# Altium project FMC_ADC_128CH_10B.PrjPCB (part 2 of 4)

## Sheet Supply_FMC_ADC128.SchDoc: FMC ADC 128CH 10B
size 420 x 297 mm; EDA_Number: ARTIQ; Projet: ARTIQ/SINARA; Author: G.Kasprowicz; CompanyName: WUT ISE; DrawnBy: G.Kasprowicz; Organization: WUT ISE; Address1: PW ISE; Address2: Nowowiejska 15/19 00-665 Warsaw; Address3: gkasprow@gmail.com; DocumentNumber: 5; Revision: 1; SheetNumber: 5; SheetTotal: 9; ModifiedBy: -; CheckedDate: -; Title2: Supply FMC ADC 128; DivGrp: WUT ISE; Designer: G.Kasprowicz; ModifiedDate: -; ProjectName: Sensor Box
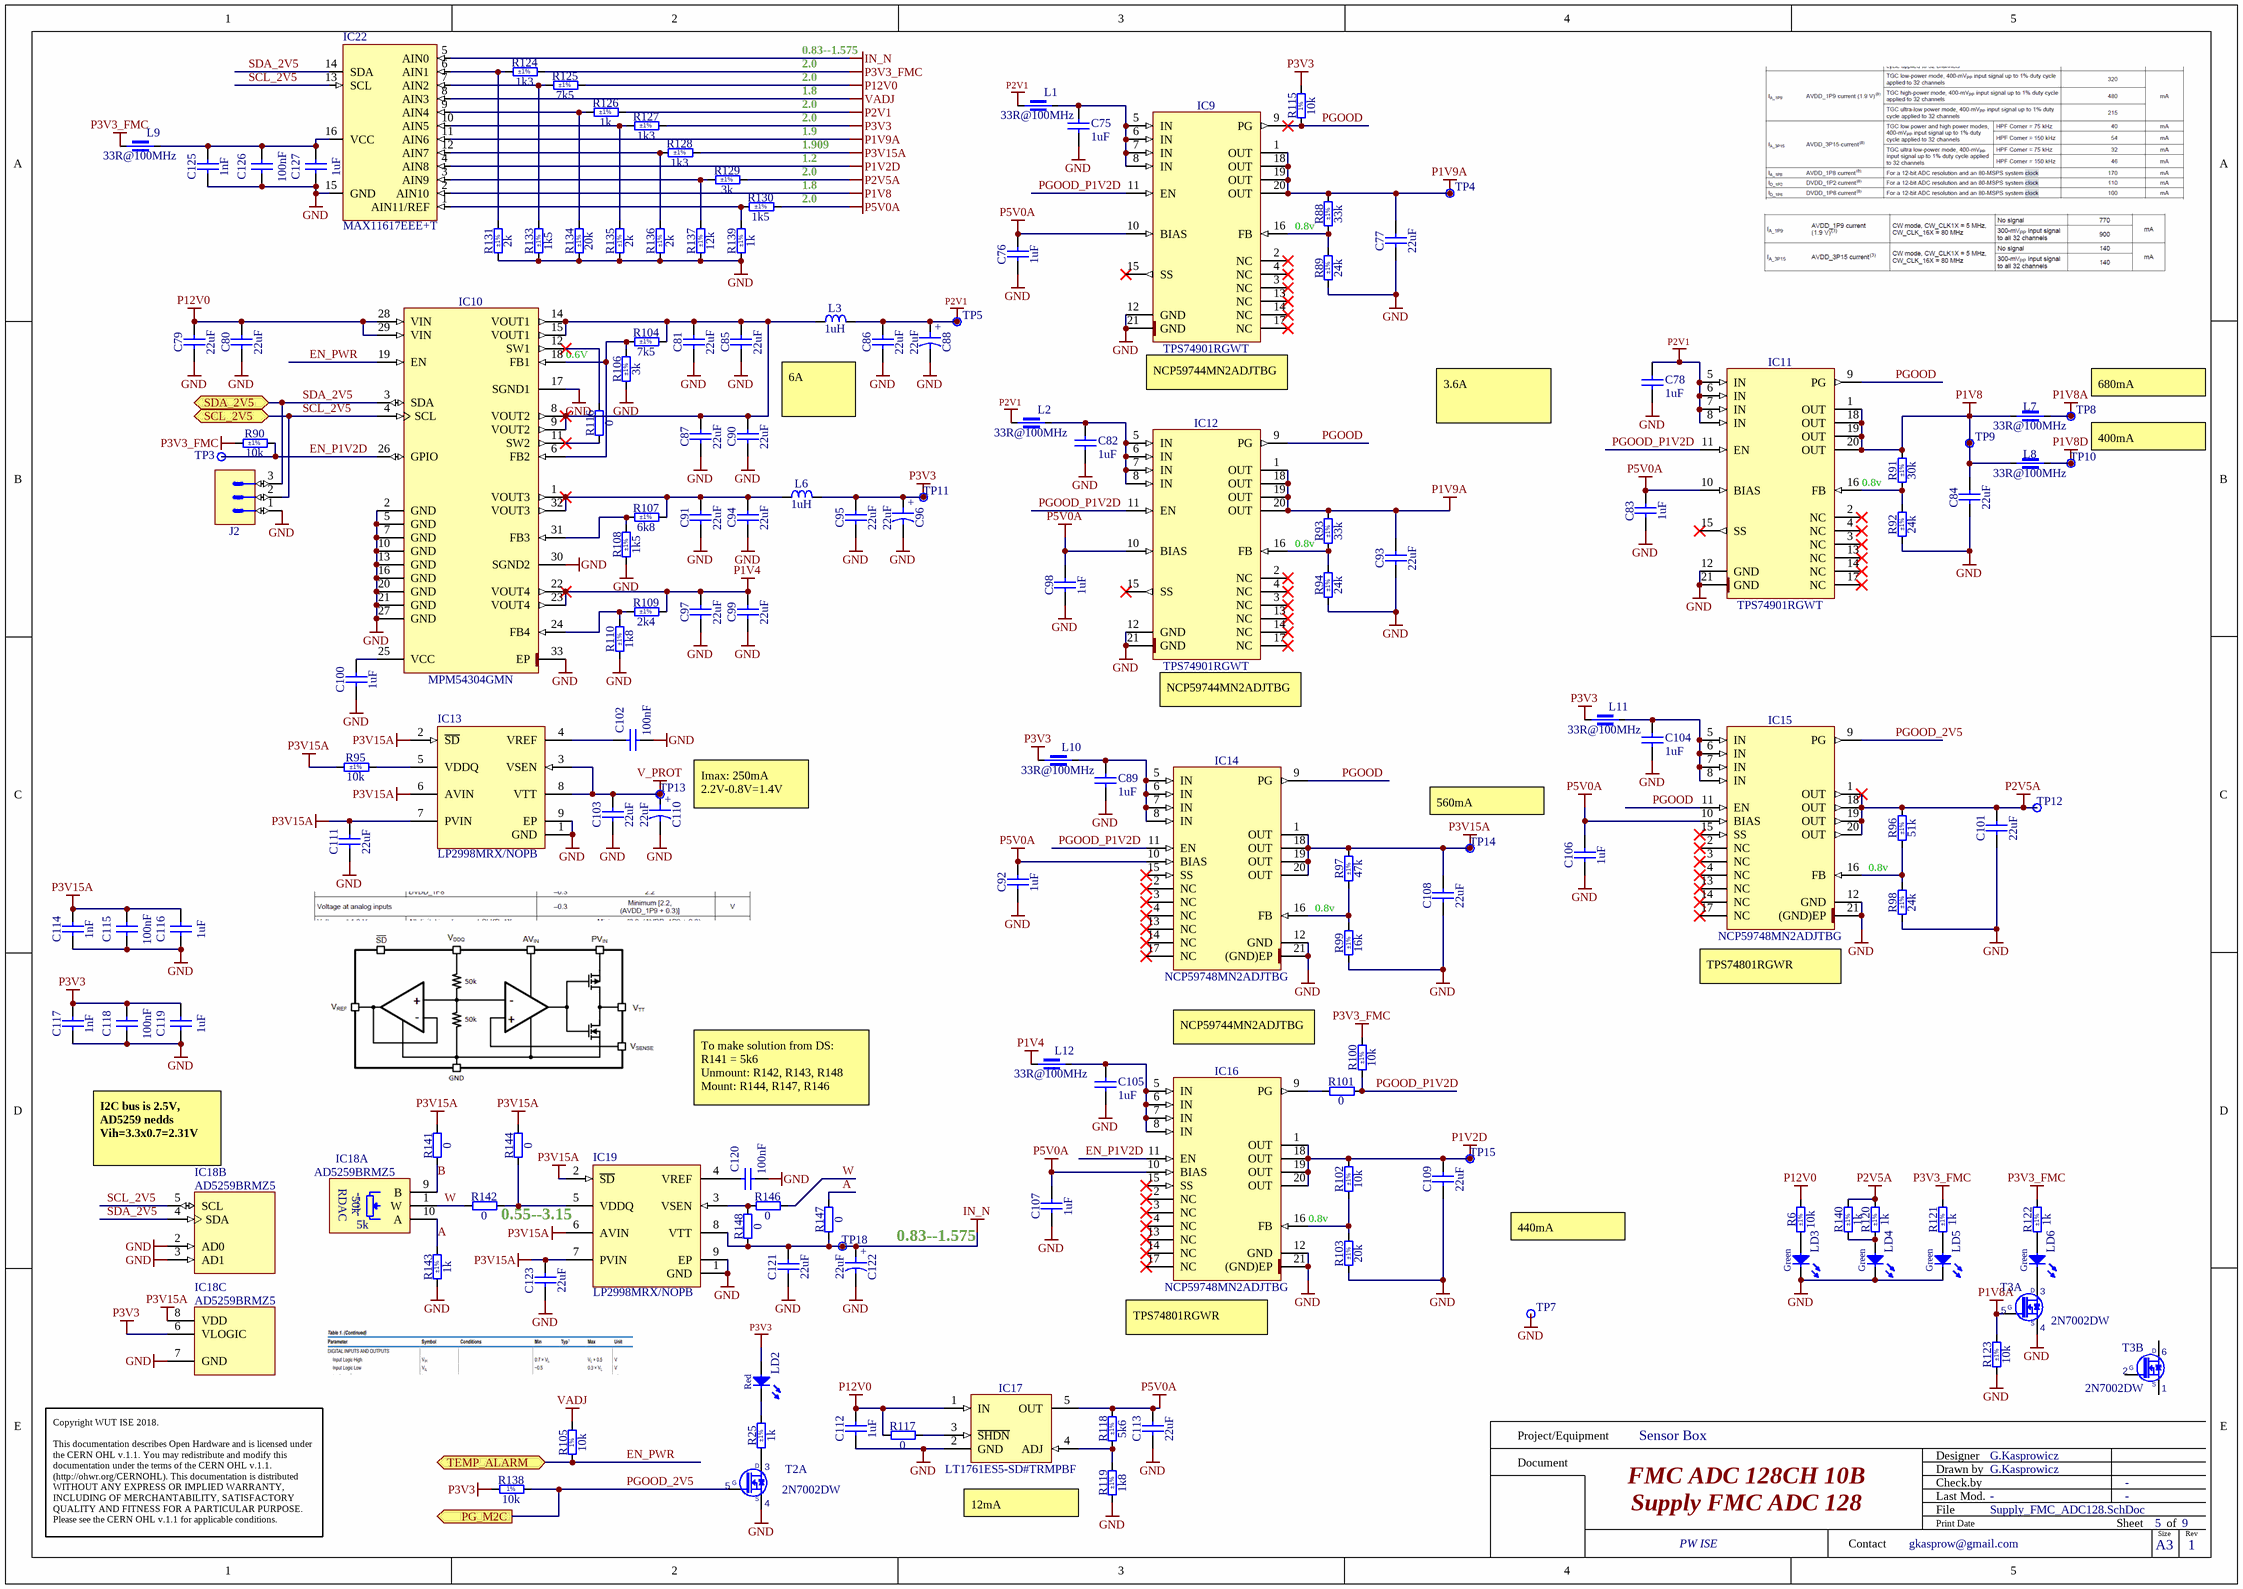
[diagram p3: Supply_FMC_ADC128.SchDoc]

### Parts
(Parts that share a designator on the sheet are numbered #1, #2 ... from top to bottom, then left to right.)
C75  1uF  [CAPC1005X55N]
C76  1uF  [CAPC1005X55N]
C77  22uF  [CAPC2012X135N]
C78  1uF  [CAPC1005X55N]
C79  22uF  [CAPC2012X135N]
C80  22uF  [CAPC2012X135N]
C81  22uF  [CAPC2012X135N]
C82  1uF  [CAPC1005X55N]
C83  1uF  [CAPC1005X55N]
C84  22uF  [CAPC2012X135N]
C85  22uF  [CAPC2012X135N]
C86  22uF  [CAPC2012X135N]
C87  22uF  [CAPC2012X135N]
C88  22uF  [CAPMP3528X210N]
C89  1uF  [CAPC1005X55N]
C90  22uF  [CAPC2012X135N]
C91  22uF  [CAPC2012X135N]
C92  1uF  [CAPC1005X55N]
C93  22uF  [CAPC2012X135N]
C94  22uF  [CAPC2012X135N]
C95  22uF  [CAPC2012X135N]
C96  22uF  [CAPMP3528X210N]
C97  22uF  [CAPC2012X135N]
C98  1uF  [CAPC1005X55N]
C99  22uF  [CAPC2012X135N]
C100  1uF  [CAPC1005X55N]
C101  22uF  [CAPC2012X135N]
C102  100nF  [CAPC1005X55N]
C103  22uF  [CAPC2012X135N]
C104  1uF  [CAPC1005X55N]
C105  1uF  [CAPC1005X55N]
C106  1uF  [CAPC1005X55N]
C107  1uF  [CAPC1005X55N]
C108  22uF  [CAPC2012X135N]
C109  22uF  [CAPC2012X135N]
C110  22uF  [CAPMP3528X210N]
C111  22uF  [CAPC2012X135N]
C112  1uF  [CAPC1005X55N]
C113  22uF  [CAPC2012X135N]
C114  1nF  [CAPC1005X55N]
C115  100nF  [CAPC1005X55N]
C116  1uF  [CAPC1005X55N]
C117  1nF  [CAPC1005X55N]
C118  100nF  [CAPC1005X55N]
C119  1uF  [CAPC1005X55N]
C120  100nF  [CAPC1005X55N]
C121  22uF  [CAPC2012X135N]
C122  22uF  [CAPMP3528X210N]
C123  22uF  [CAPC2012X135N]
C125  1nF  [CAPC1005X55N]
C126  100nF  [CAPC1005X55N]
C127  1uF  [CAPC1005X55N]
IC9  TPS74901RGWT  [QFN65P500X500X100-21N-S325]
IC10  MPM54304GMN  [MPS_MPM54304GMN]
IC11  TPS74901RGWT  [QFN65P500X500X100-21N-S325]
IC12  TPS74901RGWT  [QFN65P500X500X100-21N-S325]
IC13  LP2998MRX/NOPB  [DDA0008D_M]
IC14  NCP59748MN2ADJTBG  [QFN65P500X500X100-21N-S325]
IC15  NCP59748MN2ADJTBG  [QFN65P500X500X100-21N-S325]
IC16  NCP59748MN2ADJTBG  [QFN65P500X500X100-21N-S325]
IC17  LT1761ES5-SD#TRMPBF  [SOT95P280X100-5N]
IC18  AD5259BRMZ5  [SOP50P490X110-10N]  (parts A,B,C of 3)
IC19  LP2998MRX/NOPB  [DDA0008D_M]
IC22  MAX11617EEE+T  [16 QSOP]
J2#1  C-Grid III™  [MOLEX_90121-0763]  (value not drawn)
L1  33R@100MHz  [INDC1608X95N]
L2  33R@100MHz  [INDC1608X95N]
L3  1uH  [IND_BOURNS_SRP4020TA]
L6  1uH  [IND_BOURNS_SRN3015]
L7  33R@100MHz  [INDC1608X95N]
L8  33R@100MHz  [INDC1608X95N]
L9  33R@100MHz  [INDC1608X95N]
L10  33R@100MHz  [INDC1608X95N]
L11  33R@100MHz  [INDC1608X95N]
L12  33R@100MHz  [INDC1608X95N]
LD2  Red  [LED_AVAGO_HSMC-C110]
LD3  Green  [LED_KINGBRIGHT_KPA-1606CGCK]
LD4  Green  [LED_KINGBRIGHT_KPA-1606CGCK]
LD5  Green  [LED_KINGBRIGHT_KPA-1606CGCK]
LD6  Green  [LED_KINGBRIGHT_KPA-1606CGCK]
R6  10k  Tolerance: ±1%  [RESC1005X40N]
R25  1k  Tolerance: ±1%  [RESC1005X40N]
R88  33k  Tolerance: ±1%  [RESC1005X40N]
R89  24k  Tolerance: ±1%  [RESC1005X40N]
R90  10k  Tolerance: ±1%  [RESC1005X40N]
R91  30k  Tolerance: ±1%  [RESC1005X40N]
R92  24k  Tolerance: ±1%  [RESC1005X40N]
R93  33k  Tolerance: ±1%  [RESC1005X40N]
R94  24k  Tolerance: ±1%  [RESC1005X40N]
R95  10k  Tolerance: ±1%  [RESC1005X40N]
R96  51k  Tolerance: ±1%  [RESC1005X40N]
R97  47k  Tolerance: ±1%  [RESC1005X40N]
R98  24k  Tolerance: ±1%  [RESC1005X40N]
R99  16k  Tolerance: ±1%  [RESC1005X40N]
R100  10k  Tolerance: ±1%  [RESC1005X40N]
R101  0  [RESC1005X40N]
R102  10k  Tolerance: ±1%  [RESC1005X40N]
R103  20k  Tolerance: ±1%  [RESC1005X40N]
R104  7k5  Tolerance: ±1%  [RESC1005X40N]
R105  10k  [RESC1005X40N]
R106  3k  Tolerance: ±1%  [RESC1005X40N]
R107  6k8  Tolerance: ±1%  [RESC1005X40N]
R108  1k5  Tolerance: ±1%  [RESC1005X40N]
R109  2k4  Tolerance: ±1%  [RESC1005X40N]
R110  1k8  Tolerance: ±1%  [RESC1005X40N]
R115  10k  [RESC1005X40N]
R116  0  [RESC1005X40N]
R117  0  [RESC1005X40N]
R118  5k6  Tolerance: ±1%  [RESC1005X40N]
R119  1k8  Tolerance: ±1%  [RESC1005X40N]
R120  1k  Tolerance: ±1%  [RESC1005X40N]
R121  1k  Tolerance: ±1%  [RESC1005X40N]
R122  1k  Tolerance: ±1%  [RESC1005X40N]
R123  10k  Tolerance: ±1%  [RESC1005X40N]
R124  1k3  Tolerance: ±1%  [RESC1005X40N]
R125  7k5  Tolerance: ±1%  [RESC1005X40N]
R126  1k  Tolerance: ±1%  [RESC1005X40N]
R127  1k3  Tolerance: ±1%  [RESC1005X40N]
R128  1k3  Tolerance: ±1%  [RESC1005X40N]
R129  3k  Tolerance: ±1%  [RESC1005X40N]
R130  1k5  Tolerance: ±1%  [RESC1005X40N]
R131  2k  Tolerance: ±1%  [RESC1005X40N]
R133  1k5  Tolerance: ±1%  [RESC1005X40N]
R134  20k  Tolerance: ±1%  [RESC1005X40N]
R135  2k  Tolerance: ±1%  [RESC1005X40N]
R136  2k  Tolerance: ±1%  [RESC1005X40N]
R137  12k  Tolerance: ±1%  [RESC1005X40N]
R138  10k  [RESC1005X40N]
R139  1k  Tolerance: ±1%  [RESC1005X40N]
R140  1k  Tolerance: ±1%  [RESC1005X40N]
R141  0  [RESC1005X40N]
R142  0  [RESC1005X40N]
R143  1k  Tolerance: ±1%  [RESC1005X40N]
R144  0  [RESC1005X40N]
R146  0  [RESC1005X40N]
R147  0  [RESC1005X40N]
R148  0  [RESC1005X40N]
T2  2N7002DW  [SOT65P210X110-6N]  (part A of 2)
T3  2N7002DW  [SOT65P210X110-6N]  (parts A,B of 2)
TP3  Test Point  [TPS127]  (value not drawn)  (no BOM)
TP4  Test Point  [TPS127]  (value not drawn)  (no BOM)
TP5  Test Point  [TPS127]  (value not drawn)  (no BOM)
TP7  Test Point  [TPS127]  (value not drawn)  (no BOM)
TP8  Test Point  [TPS127]  (value not drawn)  (no BOM)
TP9  Test Point  [TPS127]  (value not drawn)  (no BOM)
TP10  Test Point  [TPS127]  (value not drawn)  (no BOM)
TP11  Test Point  [TPS127]  (value not drawn)  (no BOM)
TP12  Test Point  [TPS127]  (value not drawn)  (no BOM)
TP13  Test Point  [TPS127]  (value not drawn)  (no BOM)
TP14  Test Point  [TPS127]  (value not drawn)  (no BOM)
TP15  Test Point  [TPS127]  (value not drawn)  (no BOM)
TP18  Test Point  [TPS127]  (value not drawn)  (no BOM)

### Ports
PG_M2C (out), SCL_2V5 (bidir), SDA_2V5 (bidir), TEMP_ALARM (bidir)

### Nets
GND: C75.2 C76.1 C77.1 C78.2 C79.1 C80.1 C81.1 C82.2 C83.1 C84.1 C85.1 C86.1 C87.1 C88.2 C89.2 C90.1 C91.1 C92.1 C93.1 C94.1 C95.1 C96.2 C97.1 C98.1 C99.1 C100.1 C101.1 C102.2 C103.1 C104.2 C105.2 C106.1 C107.1 C108.1 C109.1 C110.2 C111.1 C112.1 C113.1 C114.1 C115.2 C116.1 C117.1 C118.2 C119.1 C120.2 C121.1 C122.2 C123.1 C125.1 C126.2 C127.1 IC9.12(GND) IC9.21(GND) IC10.2(GND) IC10.5(GND) IC10.7(GND) IC10.10(GND) IC10.13(GND) IC10.16(GND) IC10.17(SGND1) IC10.20(GND) IC10.21(GND) IC10.27(GND) IC10.30(SGND2) IC10.33(EP) IC11.12(GND) IC11.21(GND) IC12.12(GND) IC12.21(GND) IC13.1(GND) IC13.9(EP) IC14.12(GND) IC14.21((GND)EP) IC15.12(GND) IC15.21((GND)EP) IC16.12(GND) IC16.21((GND)EP) IC17.2(GND) IC18.2(AD0) IC18.3(AD1) IC18.7(GND) IC19.1(GND) IC19.9(EP) IC22.15(GND) J2#1.1 LD3.1(C) LD4.1(C) LD5.1(C) R89.1 R92.1 R94.1 R98.1 R99.1 R103.1 R106.1 R108.1 R110.1 R119.1 R123.1 R131.1 R133.1 R134.1 R135.1 R136.1 R137.1 R139.1 R143.1 T2.4(S1) T3.4(S1) TP7.1
IN_N: C121.2 C122.1 IC19.8(VTT) IC22.5(AIN0) R147.1 R148.1 TP18.1
P1V2D: C109.2 IC16.1(OUT) IC16.18(OUT) IC16.19(OUT) IC16.20(OUT) IC22.4(AIN8) R102.2 TP15.1
P1V4: C97.2 C99.2 IC10.22(VOUT4) IC10.23(VOUT4) L12.1 R109.2
P1V8: C84.2 IC11.1(OUT) IC11.18(OUT) IC11.19(OUT) IC11.20(OUT) IC22.2(AIN10) L7.1 L8.1 R91.2 TP9.1
P1V8A: L7.2 R123.2 T3.5(G1) TP8.1
P1V8D: L8.2 TP10.1
P1V9A: C77.2 C93.2 IC9.1(OUT) IC9.18(OUT) IC9.19(OUT) IC9.20(OUT) IC12.1(OUT) IC12.18(OUT) IC12.19(OUT) IC12.20(OUT) IC22.11(AIN6) R88.2 R93.2 TP4.1
P2V1: C78.1 C86.2 C88.1 IC11.5(IN) IC11.6(IN) IC11.7(IN) IC11.8(IN) L1.1 L2.1 L3.2 R126.2 TP5.1
P2V5A: C101.2 IC15.1(OUT) IC15.18(OUT) IC15.19(OUT) IC15.20(OUT) R96.2 R120.2 R129.2 R140.2 TP12.1
P3V3: C95.2 C96.1 C117.2 C118.1 C119.2 IC18.6(VLOGIC) L6.2 L10.1 L11.1 LD2.2(A) R115.2 R127.2 R138.1 TP11.1
P3V3_FMC: L9.1 R90.1 R100.2 R121.2 R122.2 R124.2
P3V15A: C108.2 C111.2 C114.2 C115.1 C116.2 C123.2 IC13.2(~{SD}) IC13.6(AVIN) IC13.7(PVIN) IC14.1(OUT) IC14.18(OUT) IC14.19(OUT) IC14.20(OUT) IC18.8(VDD) IC19.2(~{SD}) IC19.6(AVIN) IC19.7(PVIN) R95.1 R97.2 R128.2 R141.2 R144.2 TP14.1
P5V0A: C76.2 C83.2 C92.2 C98.2 C106.2 C107.2 C113.2 IC9.10(BIAS) IC11.10(BIAS) IC12.10(BIAS) IC14.10(BIAS) IC15.10(BIAS) IC16.10(BIAS) IC17.5(OUT) R118.2 R130.2
P12V0: C79.2 C80.2 C112.2 IC10.28(VIN) IC10.29(VIN) IC17.1(IN) R6.2 R117.1 R125.2
V_PROT: C103.2 C110.1 IC13.3(VSEN) IC13.8(VTT) TP13.1
VADJ: IC22.8(AIN3) R105.2
A: IC18.10(A) R143.2 R147.2
B: IC18.9(B) R141.1
EN_P1V2D: IC10.26(GPIO) IC16.11(EN) R90.2 TP3.1
EN_PWR: IC10.19(EN) R105.1 ; port TEMP_ALARM
PGOOD: IC9.9(PG) IC11.9(PG) IC12.9(PG) IC14.9(PG) IC15.11(EN) R115.1
PGOOD_2V5: IC15.9(PG) R138.2 T2.5(G1) ; port PG_M2C  [project net PG_M2C]
PGOOD_P1V2D: IC9.11(EN) IC11.11(EN) IC12.11(EN) IC14.11(EN) R100.1 R101.2
SCL_2V5: IC10.4(SCL) IC18.5(SCL) IC22.13(SCL) J2#1.2 ; port SCL_2V5
SDA_2V5: IC10.3(SDA) IC18.4(SDA) IC22.14(SDA) J2#1.3 ; port SDA_2V5
W: IC18.1(W) R142.1 R146.2
NetC75_1: C75.1 IC9.5(IN) IC9.6(IN) IC9.7(IN) IC9.8(IN) L1.2
NetC81_2: C81.2 C85.2 C87.2 C90.2 IC10.8(VOUT2) IC10.9(VOUT2) IC10.14(VOUT1) IC10.15(VOUT1) L3.1 R104.2
NetC82_1: C82.1 IC12.5(IN) IC12.6(IN) IC12.7(IN) IC12.8(IN) L2.2
NetC89_1: C89.1 IC14.5(IN) IC14.6(IN) IC14.7(IN) IC14.8(IN) L10.2
NetC91_2: C91.2 C94.2 IC10.1(VOUT3) IC10.32(VOUT3) L6.1 R107.2
NetC100_2: C100.2 IC10.25(VCC)
NetC102_1: C102.1 IC13.4(VREF)
NetC104_1: C104.1 IC15.5(IN) IC15.6(IN) IC15.7(IN) IC15.8(IN) L11.2
NetC105_1: C105.1 IC16.5(IN) IC16.6(IN) IC16.7(IN) IC16.8(IN) L12.2
NetC120_1: C120.1 IC19.4(VREF)
NetC125_2: C125.2 C126.1 C127.2 IC22.16(VCC) L9.2
NetIC9_16: IC9.16(FB) R88.1 R89.2
NetIC10_6: IC10.6(FB2) IC10.18(FB1) R104.1 R106.2
NetIC10_11: IC10.11(SW2) R116.1
NetIC10_12: IC10.12(SW1) R116.2
NetIC10_24: IC10.24(FB4) R109.1 R110.2
NetIC10_31: IC10.31(FB3) R107.1 R108.2
NetIC11_16: IC11.16(FB) R91.1 R92.2
NetIC12_16: IC12.16(FB) R93.1 R94.2
NetIC13_5: IC13.5(VDDQ) R95.2
NetIC14_16: IC14.16(FB) R97.1 R99.2
NetIC15_16: IC15.16(FB) R96.1 R98.2
NetIC16_9: IC16.9(PG) R101.1
NetIC16_16: IC16.16(FB) R102.1 R103.2
NetIC17_3: IC17.3(~{SHDN}) R117.2
NetIC17_4: IC17.4(ADJ) R118.1 R119.2
NetIC19_3: IC19.3(VSEN) R146.1 R148.2
NetIC19_5: IC19.5(VDDQ) R142.2 R144.1
NetIC22_1: IC22.1(AIN11/REF) R130.1 R139.2
NetIC22_3: IC22.3(AIN9) R129.1 R137.2
NetIC22_6: IC22.6(AIN1) R124.1 R131.2
NetIC22_7: IC22.7(AIN2) R125.1 R133.2
NetIC22_9: IC22.9(AIN4) R126.1 R134.2
NetIC22_10: IC22.10(AIN5) R127.1 R135.2
NetIC22_12: IC22.12(AIN7) R128.1 R136.2
NetLD2_1: LD2.1(C) R25.2
NetLD3_2: LD3.2(A) R6.1
NetLD4_2: LD4.2(A) R120.1 R140.1
NetLD5_2: LD5.2(A) R121.1
NetLD6_1: LD6.1(C) T3.3(D1)
NetLD6_2: LD6.2(A) R122.1
NetR25_1: R25.1 T2.3(D1)

Not connected (* = marked no-connect by the designer): IC9 2(NC)* 3(NC)* 4(NC)* 13(NC)* 14(NC)* 15(SS)* 17(NC)*; IC11 2(NC)* 3(NC)* 4(NC)* 13(NC)* 14(NC)* 15(SS)* 17(NC)*; IC12 2(NC)* 3(NC)* 4(NC)* 13(NC)* 14(NC)* 15(SS)* 17(NC)*; IC14 2(NC)* 3(NC)* 4(NC)* 13(NC)* 14(NC)* 15(SS)* 17(NC)*; IC15 2(NC)* 3(NC)* 4(NC)* 13(NC)* 14(NC)* 15(SS)* 17(NC)*; IC16 2(NC)* 3(NC)* 4(NC)* 13(NC)* 14(NC)* 15(SS)* 17(NC)*; T3 1(S2) 2(G2) 6(D2)

### Notes on the sheet
- 0.83--1.575
- 2.0
- 1.8
- 1.9
- 1.909
- 1.2
- (near R130) 1.8
- (near R130) 2.0
- (near R88) 0.8v
- 0.6V
- (near IC9) NCP59744MN2ADJTBG
- (near TP8) 680mA
- 6A
- 3.6A
- 400mA
- 0.8v
- (near R93) 0.8v
- (near IC12) NCP59744MN2ADJTBG
- Imax: 250mA
  2.2V-0.8V=1.4V
- 560mA
- (near IC15) TPS74801RGWR
- NCP59744MN2ADJTBG
- To make solution from DS:
  R141 = 5k6
  Unmount: R142, R143, R148
  Mount: R144, R147, R146
- I2C bus is 2.5V, AD5259 nedds Vih=3.3x0.7=2.31V
- (near IC18) ------
- (near IC18) 5k
- 0.55--3.15
- 440mA
- (near IC16) TPS74801RGWR
- 12mA
- Project/Equipment
- Document
- Designer
- Drawn by
- Check.by
- Copyright WUT ISE 2018.
  This documentation describes Open Hardware and is licensed under the CERN OHL v.1.1. You may redistribute and modify this documentation under the terms of the CERN OHL v.1.1. (http://ohwr.org/CERNOHL). This documentation is distributed WITHOUT ANY EXPRESS OR IMPLIED WARRANTY, INCLUDING OF MERCHANTABILITY, SATISFACTORY QUALITY AND FITNESS FOR A PARTICULAR PURPOSE. Please see the CERN OHL v.1.1 for applicable conditions.
- Contact
- File
- Last Mod.
- Print Date
- Sheet
- Size
- A3
- of
- Rev
- (in symbol 2N7002DW, part A) D; G; S
- (in symbol 2N7002DW, part B) D; G; S
- (in symbol AD5259BRMZ50, part A) RDAC; 50k
- (in symbol CTE3528-21_22UF_10V_10%_LESR0700) +
- (in symbol R0402_10K_1%_0.0625W_100PPM) 1%

### Library data of the parts
C75 C76 C78 C82 C83 C89 C92 C98 C100 C104-C107 C112 = CC0402_1UF_16V_10%_X5R: Non-polarised capacitor; Part Description: SMD Multilayer Chip Ceramic Capacitor; Manufacturer: GENERIC; Manufacturer1 Part Number: C1005X5R1C105KT; Voltage: 16V; TC: X5R; Tolerance: ±10%; Part Number: CC0402_1UF_16V_10%_X5R; Component Kind: Standard; Component Type: Standard; Pin Count: 2; Value: 1uF; Status: Preferred; Manufacturer Part Number: CC0402_1UF_16V_10%_X5R; Case: 0402; Mounted: Yes; Socket: No; SMD: Yes; Sense: No; Manufacturer1 Example: TDK; Manufacturer1 ComponentHeight: 0.55mm; HelpURL: \\cern.ch\dfs\Applications\Altium\Datasheets\CC0402_X5R_TDK_C.pdf; Author: CERN DEM JLC; CreateDate: 2012-10-25; LatestRevisionDate: 2012-10-25
C77 C79-C81 C84-C87 C90 C91 C93-C95 C97 C99 C101 C103 C108 C109 C111 C113 C121 C123 = CC0805_22UF_16V_10%_X5R: Non-polarised capacitor; Part Description: SMD Multilayer Chip Ceramic Capacitor; Manufacturer: GENERIC; Manufacturer1 Part Number: C2012X5R1C226KT; Voltage: 16V; TC: X5R; Tolerance: ±10%; Part Number: CC0805_22UF_16V_10%_X5R; Component Kind: Standard; Component Type: Standard; Pin Count: 2; Value: 22uF; Status: Preferred; Manufacturer Part Number: CC0805_22UF_16V_10%_X5R; Case: 0805; Mounted: Yes; Socket: No; SMD: Yes; Sense: No; Manufacturer1 Example: TDK; Manufacturer1 ComponentHeight: 1.35mm; HelpURL: \\cern.ch\dfs\Applications\Altium\Datasheets\CC0805_X5R_TDK_C.pdf; Author: CERN DEM JLC; CreateDate: 25.10.2012; LatestRevisionDate: 25.10.2012
C88 C96 C110 C122 = CTE3528-21_22UF_10V_10%_LESR0700: Polarised capacitor; Part Description: Low ESR 0R7 Solid Tantalum Chip Capacitor; Manufacturer: GENERIC; Manufacturer1 Part Number: TPSB226K010R0700; Voltage: 10V; Tolerance: ±10%; Part Number: CTE3528-21_22UF_10V_10%_LESR0700; Component Kind: Standard; Component Type: Standard; Pin Count: 2; Value: 22uF; Status: Preferred; Manufacturer Part Number: CTE3528-21_22UF_10V_10%_LESR0700; Case: B; Mounted: Yes; Socket: No; SMD: Yes; Sense: No; Manufacturer1 Example: AVX; Manufacturer1 ComponentHeight: 2.1mm; HelpURL: \\cern.ch\dfs\Applications\Altium\Datasheets\CTE-LESR_AVX_TPS.pdf; Author: CERN DEM JLC; CreateDate: 05.05.2008; LatestRevisionDate: 20.01.2009
C102 C115 C118 C120 C126 = CC0402_100NF_16V_10%_X5R: Non-polarised capacitor; Part Description: SMD Multilayer Chip Ceramic Capacitor; Manufacturer: GENERIC; Manufacturer1 Part Number: GRM155R61C104KA88D; Voltage: 16V; TC: X5R; Tolerance: ±10%; Part Number: CC0402_100NF_16V_10%_X5R; Component Kind: Standard; Component Type: Standard; Pin Count: 2; Value: 100nF; Status: None; Manufacturer Part Number: CC0402_100NF_16V_10%_X5R; Case: 0402; Mounted: Yes; Socket: No; SMD: Yes; Manufacturer1 Example: MURATA; Manufacturer1 ComponentHeight: 0.55mm; HelpURL: \\cern.ch\dfs\Applications\Altium\Datasheets\CC0402_X5R_MURATA_GRM.pdf; Author: CERN DEM JLC; CreateDate: 10.12.2013; LatestRevisionDate: 10.12.2013; Sense: No
C114 C117 C125 = CC0402_1NF_50V_10%_X7R: Non-polarised capacitor; Part Description: SMD Multilayer Chip Ceramic Capacitor; Manufacturer: GENERIC; Manufacturer1 Part Number: 223858715623; Voltage: 50V; TC: X7R; Tolerance: ±10%; Part Number: CC0402_1NF_50V_10%_X7R; Component Kind: Standard; Component Type: Standard; Pin Count: 2; Value: 1nF; Status: Not Recommended; Manufacturer Part Number: CC0402_1NF_50V_10%_X7R; Case: 0402; Mounted: Yes; Socket: No; SMD: Yes; Sense: No; Manufacturer1 Example: PHYCOMP; Manufacturer1 ComponentHeight: 0.55mm; HelpURL: \\cern.ch\dfs\Applications\Altium\Datasheets\CC0402_X7R_PHYCOMP.pdf; Author: CERN DEM JLC; CreateDate: 03.12.2007; LatestRevisionDate: 03.12.2007
C116 C119 C127 = CC0402_1UF_25V_10%_X5R: Non-polarised capacitor; Part Description: SMD Multilayer Chip Ceramic Capacitor; Manufacturer: GENERIC; Manufacturer1 Part Number: C1005X5R1E105K050; Voltage: 25V; TC: X5R; Tolerance: ±10%; Part Number: CC0402_1UF_25V_10%_X5R; Component Kind: Standard; Component Type: Standard; Pin Count: 2; Value: 1uF; Status: Preferred; Manufacturer Part Number: CC0402_1UF_25V_10%_X5R; Case: 0402; Mounted: Yes; Socket: No; SMD: Yes; Sense: No; Manufacturer1 Example: TDK; Manufacturer1 ComponentHeight: 0.55mm; HelpURL: \\cern.ch\dfs\Applications\Altium\Datasheets\CC0402_X5R_TDK_C.pdf; Author: CERN DEM BC; CreateDate: 17.02.2020; LatestRevisionDate: 17.02.2020
IC9 IC11 IC12 = TPS74901RGWT: 3A, 0.8 to 3.6V Adjustable Low-Dropout Linear Regulator with Programmable Soft-Start; Part Description: 0.8V to 3.6V, 3.0A Low Dropout Linear Regulator with Programmable Soft-Start; Manufacturer: TEXAS INSTRUMENTS; PressFit: No; Bonding: No; Part Number: TPS74901RGWT; Component Kind: Standard; Component Type: Standard; Device: TPS74901RGWT; PackageDescription: QFN, 0.65mm pitch,square; 20 pin, 5mm X 5mm X 1mm H body (w/thermal tab 3.25 X 3.25mm),  IPC Medium Density; Manufacturer Part Number: TPS74901RGWT; Pin Count: 21; Case: QFN20; Mounted: Yes; Socket: No; SMD: Yes; Sense: No; ComponentHeight: 1mm; HelpURL: \\cern.ch\dfs\Applications\Altium\Datasheets\TPS74901RGWT.pdf; Author: CERN DEM JLC; CreateDate: 07.03.2013; LatestRevisionDate: 07.03.2013
IC10 = MPM54304GMN: Quad-Output Power Module with I2C and MTP; Part Description: 4V to 16V Input, Quad-Output Power Module with I2C and MTP; Manufacturer: MPS (MONOLITIC  POWER SYSTEMS); PressFit: No; Bonding: No; Part Number: MPM54304GMN; Component Kind: Standard; Component Type: Standard; Device: MPM54304GMN; PackageDescription: MPS LGA-33 Case, 0.65mm Pitch, Rect.; 32 Pin, 7.00mm L X 7.00mm W X 2.10mm H body (w/Thermal Tab 3.55 X 3.55mm); Manufacturer Part Number: MPM54304GMN; Pin Count: 33; Case: QFN32; Mounted: Yes; Socket: No; SMD: Yes; Sense: No; ComponentHeight: 2.1mm; HelpURL: \\cern.ch\dfs\Applications\Altium\Datasheets\MPM54304GMN.pdf; Author: CERN DEM BC; CreateDate: 09.11.2020; LatestRevisionDate: 09.11.2020
IC13 IC19 = CMP-0063-00622-3: DDR-I and DDR-II Termination Regulator, 8-pin PSOP, Pb-Free; Manufacturer: Texas Instruments; PackageTopMarking: NSXYTT*LP2998*MR; PowerWise: N; CompType: MiscPower; PackageReference: DDA0008D; RoHS: Y; PinCount: 8; Code_JEDEC: MS-012-AA; PackageDescription: Molded, PSOP .193 x .154 x .058in, 8 Lead, .050in Pitch; ComponentLink1URL: http://www.ti.com/general/docs/lit/getliterature.tsp?genericPartNumber=LP2998&fileType=pdf; ComponentLink1Description: Datasheet URL
IC14-IC16 = NCP59748MN2ADJTBG: 1.5A, Dual-Rail Very Low‐Dropout Linear Regulator with Programmable Soft‐Start; Part Description: 0.8V to  3.6V, 1.5A, Dual-Rail, Very Low‐Dropout Linear Regulator with Programmable Soft‐Start; Manufacturer: ON SEMICONDUCTOR; PressFit: No; Bonding: No; Part Number: NCP59748MN2ADJTBG; Component Kind: Standard; Component Type: Standard; Device: NCP59748MN2ADJTBG; PackageDescription: QFN, 0.65mm Pitch, Square; 20 Pin, 5.00mm L X 5.00mm W X 1.00mm H body (w/Thermal Tab 3.25 X 3.25mm), IPC Medium Density; Manufacturer Part Number: NCP59748MN2ADJTBG; Pin Count: 21; Case: QFN20; Mounted: Yes; Socket: No; SMD: Yes; Sense: No; ComponentHeight: 1mm; HelpURL: \\cern.ch\dfs\Applications\Altium\Datasheets\NCP59748MN2ADJTBG.pdf; Author: CERN DEM MR; CreateDate: 23.08.2018; LatestRevisionDate: 23.08.2018
IC17 = LT1761ES5-SD#TRMPBF: 100mA, Low Noise, LDO Micropower Adjustable Regulator in SOT-23; Part Description: 1.22V to 20V, 100mA, Low Noise, LDO Adjustable Micropower Regulator; Manufacturer: LINEAR TECHNOLOGY; PressFit: No; Bonding: No; Part Number: LT1761ES5-SD#TRMPBF; Component Kind: Standard; Component Type: Standard; Device: LT1761ES5-SD#TRMPBF; PackageDescription: SOT23, 0.95mm Pitch; 5 Pin, 1.60mm W X 2.90mm L X 1.00mm H body, IPC Medium Density; Manufacturer Part Number: LT1761ES5-SD; Pin Count: 5; Case: SOT23-5; Mounted: Yes; Socket: No; SMD: Yes; Sense: No; ComponentHeight: 1mm; HelpURL: \\cern.ch\dfs\Applications\Altium\Datasheets\LT1761ES5-SD#TRMPBF.pdf; Author: CERN DEM JLC; CreateDate: 26.08.2013; LatestRevisionDate: 02.06.2022
IC18 = AD5259BRMZ50: Nonvolatile, I2C-Compatible 256-Position, 5k Digital Potentiometer; Manufacturer: ANALOG DEVICES; PressFit: No; Bonding: No; Part Number: AD5259BRMZ5; Component Kind: Standard; Component Type: Standard; Device: AD5259BRMZ5; PackageDescription: SOP, 0.50mm Pitch; 10 Pin, 3.00mm W X 3.00mm L X 1.10mm H body, IPC Medium Density; Part Description: Nonvolatile, I2C-Compatible 256-Position, 5k Digital Potentiometer; Manufacturer Part Number: AD5259BRMZ5; Pin Count: 10; Case: MSOP10; Mounted: Yes; Socket: No; SMD: Yes; Sense: No; ComponentHeight: 1.1mm; Author: CERN DEM MR; HelpURL: \\cern.ch\dfs\Applications\Altium\Datasheets\AD5259BRMZ50.pdf; CreateDate: 10.10.2016; LatestRevisionDate: 10.10.2016
IC22 = MAX11617: 12-, 2-Wire Serial 12-Bit ADCs; Manufacturer: Maxim Integrated; Manufacturer Part Number: MAX11617EEE+T
J2#1 = MOLEX_90121-0763: Connector 3 Male; Part Description: 2.54mm (.100") Pitch, 3 Circuits  Single Row  Right Angle C-Grid III™ Header; Manufacturer: MOLEX; PressFit: No; Part Number: MOLEX_90121-0763; Component Kind: Standard; Component Type: Standard; Pin Count: 3; Family: C-Grid III™; Mounted: Yes; Socket: No; SMD: No; Sense: No; Status: None; Manufacturer Part Number: 90121-0763; ComponentHeight: 3.6mm; HelpURL: \\cern.ch\dfs\Applications\Altium\Datasheets\MOLEX_90121-0763.pdf; Author: CERN DEM JLC; CreateDate: 23.04.2018; LatestRevisionDate: 23.04.2018
L1 L2 L7-L12 = IND0603_MURATA_BLM18PG330SN1D: Part Description: SMD EMIFIL Chip Ferrite Bead; Manufacturer: MURATA; Power: 3A; Resistance: 0.025R; Tolerance: ±25%; Part Number: IND0603_MURATA_BLM18PG330SN1D; Component Kind: Standard; Component Type: Standard; Pin Count: 2; Value: 33R@100MHz; Manufacturer Part Number: BLM18PG330SN1D; Case: 0603; Mounted: Yes; Socket: No; SMD: Yes; Sense: No; ComponentHeight: 0.95mm; HelpURL: \\cern.ch\dfs\Applications\Altium\Datasheets\IND0603_MURATA_BLM18P.pdf; Author: CERN DEM JMW; CreateDate: 19.02.2014; LatestRevisionDate: 25.10.2018
L3 = IND_1UH_20%_BOURNS_SRP4020TA: Inductor; Part Description: Shielded Power Inductor; Manufacturer: BOURNS; Manufacturer Part Number: SRP4020TA-1R0M; Power: 5A; Resistance: 0.027R; Tolerance: ±20%; Part Number: IND_1UH_20%_BOURNS_SRP4020TA; Component Kind: Standard; Component Type: Standard; Pin Count: 2; Value: 1uH; Mounted: Yes; Socket: No; SMD: Yes; Sense: No; ComponentHeight: 2mm; HelpURL: \\cern.ch\dfs\Applications\Altium\Datasheets\IND_BOURNS_SRP4020TA.pdf; Author: CERN DEM BC; CreateDate: 02.09.2015; LatestRevisionDate: 02.09.2015
L6 = IND_1UH_30%_BOURNS_SRN3015: Inductor; Part Description: Semi-Shielded SMD Power Inductor; Manufacturer: BOURNS; Manufacturer Part Number: SRN3015-1R0Y; Power: 2.35A; Resistance: 0.048R; Tolerance: ±30%; Part Number: IND_1UH_30%_BOURNS_SRN3015; Component Kind: Standard; Component Type: Standard; Pin Count: 2; Value: 1uH; Mounted: Yes; Socket: No; SMD: Yes; Sense: No; ComponentHeight: 1.5mm; HelpURL: \\cern.ch\dfs\Applications\Altium\Datasheets\IND_BOURNS_SRN3015.pdf; Author: CERN DEM JLC; CreateDate: 03.02.2015; LatestRevisionDate: 03.02.2015
LD2 = LED_AVAGO_HSMC-C110: LED Red 1C 2A; Part Description: High Performance Right Angle Chip Red LED; Manufacturer: AVAGO TECHNOLOGIES; PressFit: No; Bonding: No; Part Number: LED_AVAGO_HSMC-C110; Component Kind: Standard; Component Type: Standard; Color: Red; PackageDescription: Red Chip LED, 2-Leads, Body 3.3x1.6mm, Side Emitting Package; Manufacturer Part Number: HSMC-C110; Pin Count: 2; Case: 1206; Mounted: Yes; Socket: No; SMD: Yes; Sense: No; ComponentHeight: 1.1mm; HelpURL: \\cern.ch\dfs\Applications\Altium\Datasheets\LED_AVAGO_HSMC-C110.pdf; ComponentLink1URL: \\cern.ch\dfs\Applications\Altium\Datasheets\LED_AVAGO_HSMC-C110_DESIGN-GUIDE.pdf; ComponentLink1Description: Design Guide; Author: CERN DEM JMW; CreateDate: 30.07.2009; LatestRevisionDate: 20.06.2012
LD3-LD6 = LED_KINGBRIGHT_KPA-1606CGCK: LED Green 1C 2A; Part Description: SMD Green LED, Right Angle Mount, Body L 1.6 x W 0.6mm, 1.2mm Thickness; PressFit: No; Bonding: No; Part Number: LED_KINGBRIGHT_KPA-1606CGCK; Component Kind: Standard; Component Type: Standard; Color: Green; PackageDescription: SMT Green LED, Right Angle Mount, Body L 1.6 x W 0.6mm H 1.2mm; Status: Not Recommended; Manufacturer: KINGBRIGHT; Manufacturer Part Number: KPA-1606CGCK; Pin Count: 2; Case: 0603; Mounted: Yes; Socket: No; SMD: Yes; Sense: No; ComponentHeight: 1.2mm; HelpURL: \\cern.ch\dfs\Applications\Altium\Datasheets\LED_KINGBRIGHT_KPA-1606CGCK.pdf; Author: CERN DEM MR; CreateDate: 18.12.2017; LatestRevisionDate: 18.12.2017
R6 R90 R95 R100 R102 R123 R138 = R0402_10K_1%_0.0625W_100PPM: Resistor - 1%; Part Description: General Purpose Thick Film Chip Resistor; Manufacturer: GENERIC; Manufacturer1 Part Number: 232270671003L; TC: ±100ppm/°C; PressFit: No; Part Number: R0402_10K_1%_0.0625W_100PPM; Component Kind: Standard; Component Type: Standard; Pin Count: 2; Value: 10k; Status: Not Recommended; Power: 0.0625W; Manufacturer Part Number: R0402_10K_1%_0.0625W_100PPM; Case: 0402; Mounted: Yes; Sense: No; Socket: No; SMD: Yes; Manufacturer1 Example: YAGEO PHYCOMP; Manufacturer1 ComponentHeight: 0.4mm; HelpURL: \\cern.ch\dfs\Applications\Altium\Datasheets\R0402_Phycomp_RC0402.pdf; Author: CERN DEM JLC; CreateDate: 03.12.2007; LatestRevisionDate: 17.10.2012
  R138: Tolerance: ±1%
R25 R120-R122 R126 R139 R140 R143 = R0402_1K_1%_0.0625W_100PPM: Resistor - 1%; Part Description: General Purpose Thick Film Chip Resistor; Manufacturer: GENERIC; Manufacturer1 Part Number: 232270671002L; TC: ±100ppm/°C; PressFit: No; Part Number: R0402_1K_1%_0.0625W_100PPM; Component Kind: Standard; Component Type: Standard; Pin Count: 2; Value: 1k; Status: Not Recommended; Power: 0.0625W; Manufacturer Part Number: R0402_1K_1%_0.0625W_100PPM; Case: 0402; Mounted: Yes; Sense: No; Socket: No; SMD: Yes; Manufacturer1 Example: YAGEO PHYCOMP; Manufacturer1 ComponentHeight: 0.4mm; HelpURL: \\cern.ch\dfs\Applications\Altium\Datasheets\R0402_Phycomp_RC0402.pdf; Author: CERN DEM JLC; CreateDate: 03.12.2007; LatestRevisionDate: 17.10.2012
R88 R93 = R0402_33K_1%_0.0625W_100PPM: Resistor - 1%; Part Description: General Purpose Thick Film Chip Resistor; Manufacturer: GENERIC; Manufacturer1 Part Number: 232270673303L; TC: ±100ppm/°C; PressFit: No; Part Number: R0402_33K_1%_0.0625W_100PPM; Component Kind: Standard; Component Type: Standard; Pin Count: 2; Value: 33k; Status: Not Recommended; Power: 0.0625W; Manufacturer Part Number: R0402_33K_1%_0.0625W_100PPM; Case: 0402; Mounted: Yes; Sense: No; Socket: No; SMD: Yes; Manufacturer1 Example: YAGEO PHYCOMP; Manufacturer1 ComponentHeight: 0.4mm; HelpURL: \\cern.ch\dfs\Applications\Altium\Datasheets\R0402_Phycomp_RC0402.pdf; Author: CERN DEM JLC; CreateDate: 03.12.2007; LatestRevisionDate: 17.10.2012
R89 R92 R94 R98 = R0402_24K_1%_0.0625W_100PPM: Resistor - 1%; Part Description: General Purpose Thick Film Chip Resistor; Manufacturer: GENERIC; Manufacturer1 Part Number: 232270672403L; TC: ±100ppm/°C; PressFit: No; Part Number: R0402_24K_1%_0.0625W_100PPM; Component Kind: Standard; Component Type: Standard; Pin Count: 2; Value: 24k; Status: Not Recommended; Power: 0.0625W; Manufacturer Part Number: R0402_24K_1%_0.0625W_100PPM; Case: 0402; Mounted: Yes; Sense: No; Socket: No; SMD: Yes; Manufacturer1 Example: YAGEO PHYCOMP; Manufacturer1 ComponentHeight: 0.4mm; HelpURL: \\cern.ch\dfs\Applications\Altium\Datasheets\R0402_Phycomp_RC0402.pdf; Author: CERN DEM JLC; CreateDate: 03.12.2007; LatestRevisionDate: 17.10.2012
R91 = R0402_30K_1%_0.0625W_100PPM: Resistor - 1%; Part Description: General Purpose Thick Film Chip Resistor; Manufacturer: GENERIC; Manufacturer1 Part Number: 232270673003L; TC: ±100ppm/°C; PressFit: No; Part Number: R0402_30K_1%_0.0625W_100PPM; Component Kind: Standard; Component Type: Standard; Pin Count: 2; Value: 30k; Status: Not Recommended; Power: 0.0625W; Manufacturer Part Number: R0402_30K_1%_0.0625W_100PPM; Case: 0402; Mounted: Yes; Sense: No; Socket: No; SMD: Yes; Manufacturer1 Example: YAGEO PHYCOMP; Manufacturer1 ComponentHeight: 0.4mm; HelpURL: \\cern.ch\dfs\Applications\Altium\Datasheets\R0402_Phycomp_RC0402.pdf; Author: CERN DEM JLC; CreateDate: 03.12.2007; LatestRevisionDate: 17.10.2012
R96 = R0402_51K_1%_0.0625W_100PPM: Resistor - 1%; Part Description: General Purpose Thick Film Chip Resistor; Manufacturer: GENERIC; Manufacturer1 Part Number: 232270675103L; TC: ±100ppm/°C; PressFit: No; Part Number: R0402_51K_1%_0.0625W_100PPM; Component Kind: Standard; Component Type: Standard; Pin Count: 2; Value: 51k; Status: Not Recommended; Power: 0.0625W; Manufacturer Part Number: R0402_51K_1%_0.0625W_100PPM; Case: 0402; Mounted: Yes; Sense: No; Socket: No; SMD: Yes; Manufacturer1 Example: YAGEO PHYCOMP; Manufacturer1 ComponentHeight: 0.4mm; HelpURL: \\cern.ch\dfs\Applications\Altium\Datasheets\R0402_Phycomp_RC0402.pdf; Author: CERN DEM JLC; CreateDate: 03.12.2007; LatestRevisionDate: 17.10.2012
R97 = R0402_47K_1%_0.0625W_100PPM: Resistor - 1%; Part Description: General Purpose Thick Film Chip Resistor; Manufacturer: GENERIC; Manufacturer1 Part Number: 232270674703L; TC: ±100ppm/°C; PressFit: No; Part Number: R0402_47K_1%_0.0625W_100PPM; Component Kind: Standard; Component Type: Standard; Pin Count: 2; Value: 47k; Status: Not Recommended; Power: 0.0625W; Manufacturer Part Number: R0402_47K_1%_0.0625W_100PPM; Case: 0402; Mounted: Yes; Sense: No; Socket: No; SMD: Yes; Manufacturer1 Example: YAGEO PHYCOMP; Manufacturer1 ComponentHeight: 0.4mm; HelpURL: \\cern.ch\dfs\Applications\Altium\Datasheets\R0402_Phycomp_RC0402.pdf; Author: CERN DEM JLC; CreateDate: 03.12.2007; LatestRevisionDate: 17.10.2012
R99 = R0402_16K_1%_0.0625W_100PPM: Resistor - 1%; Part Description: General Purpose Thick Film Chip Resistor; Manufacturer: GENERIC; Manufacturer1 Part Number: 232270671603L; TC: ±100ppm/°C; PressFit: No; Part Number: R0402_16K_1%_0.0625W_100PPM; Component Kind: Standard; Component Type: Standard; Pin Count: 2; Value: 16k; Status: Not Recommended; Power: 0.0625W; Manufacturer Part Number: R0402_16K_1%_0.0625W_100PPM; Case: 0402; Mounted: Yes; Sense: No; Socket: No; SMD: Yes; Manufacturer1 Example: YAGEO PHYCOMP; Manufacturer1 ComponentHeight: 0.4mm; HelpURL: \\cern.ch\dfs\Applications\Altium\Datasheets\R0402_Phycomp_RC0402.pdf; Author: CERN DEM JLC; CreateDate: 03.12.2007; LatestRevisionDate: 17.10.2012
R101 R116 R117 R141 R142 R144 R146-R148 = R0402_0R_JUMPER: Resistor; Part Description: 1A (0.05R Max DC Resistance) Zero Ohm Jumper; Manufacturer: GENERIC; Manufacturer1 Part Number: 232270591001L; PressFit: No; Part Number: R0402_0R_JUMPER; Component Kind: Standard; Component Type: Standard; Pin Count: 2; Value: 0; Status: Not Recommended; Manufacturer Part Number: R0402_0R_JUMPER; Case: 0402; Mounted: Yes; Sense: No; Socket: No; SMD: Yes; Manufacturer1 Example: YAGEO PHYCOMP; Manufacturer1 ComponentHeight: 0.4mm; HelpURL: \\cern.ch\dfs\Applications\Altium\Datasheets\R0402_Phycomp_RC0402.pdf; Author: CERN DEM JLC; CreateDate: 03.12.2007; LatestRevisionDate: 17.10.2012
R103 R134 = R0402_20K_1%_0.0625W_100PPM: Resistor - 1%; Part Description: General Purpose Thick Film Chip Resistor; Manufacturer: GENERIC; Manufacturer1 Part Number: 232270672003L; TC: ±100ppm/°C; PressFit: No; Part Number: R0402_20K_1%_0.0625W_100PPM; Component Kind: Standard; Component Type: Standard; Pin Count: 2; Value: 20k; Status: Not Recommended; Power: 0.0625W; Manufacturer Part Number: R0402_20K_1%_0.0625W_100PPM; Case: 0402; Mounted: Yes; Sense: No; Socket: No; SMD: Yes; Manufacturer1 Example: YAGEO PHYCOMP; Manufacturer1 ComponentHeight: 0.4mm; HelpURL: \\cern.ch\dfs\Applications\Altium\Datasheets\R0402_Phycomp_RC0402.pdf; Author: CERN DEM JLC; CreateDate: 03.12.2007; LatestRevisionDate: 17.10.2012
R104 R125 = R0402_7K5_1%_0.0625W_100PPM: Resistor - 1%; Part Description: General Purpose Thick Film Chip Resistor; Manufacturer: GENERIC; Manufacturer1 Part Number: 232270677502L; TC: ±100ppm/°C; PressFit: No; Part Number: R0402_7K5_1%_0.0625W_100PPM; Component Kind: Standard; Component Type: Standard; Pin Count: 2; Value: 7k5; Status: Not Recommended; Power: 0.0625W; Manufacturer Part Number: R0402_7K5_1%_0.0625W_100PPM; Case: 0402; Mounted: Yes; Sense: No; Socket: No; SMD: Yes; Manufacturer1 Example: YAGEO PHYCOMP; Manufacturer1 ComponentHeight: 0.4mm; HelpURL: \\cern.ch\dfs\Applications\Altium\Datasheets\R0402_Phycomp_RC0402.pdf; Author: CERN DEM JLC; CreateDate: 03.12.2007; LatestRevisionDate: 17.10.2012
R105 R115 = R0402_10K_1%_0.0625W_100PPM: Resistor - 1%; Part Description: General Purpose Thick Film Chip Resistor; Manufacturer: GENERIC; Manufacturer1 Part Number: 232270671003L; TC: ±100ppm/°C; Table: Resistors SMD; Part Number: R0402_10K_1%_0.0625W_100PPM; Component Kind: Standard; Component Type: Standard; Pin Count: 2; Value: 10k; Status: Not recommended; Power: 0.0625W; Tolerance: ±1%; Manufacturer Part Number: R0402_10K_1%_0.0625W_100PPM; Case: 0402; Mounted: Yes; Socket: No; SMD: Yes; Manufacturer1 Example: YAGEO PHYCOMP; Manufacturer1 ComponentHeight: 0.4mm; HelpURL: \\cern.ch\dfs\Applications\Altium\Datasheets\R0402_Phycomp_RC0402.pdf; Author: CERN DEM JLC; CreateDate: 3/12/2007; LatestRevisionDate: 17/10/2012
R106 R129 = R0402_3K_1%_0.0625W_100PPM: Resistor - 1%; Part Description: General Purpose Thick Film Chip Resistor; Manufacturer: GENERIC; Manufacturer1 Part Number: 232270673002L; TC: ±100ppm/°C; PressFit: No; Part Number: R0402_3K_1%_0.0625W_100PPM; Component Kind: Standard; Component Type: Standard; Pin Count: 2; Value: 3k; Status: Not Recommended; Power: 0.0625W; Manufacturer Part Number: R0402_3K_1%_0.0625W_100PPM; Case: 0402; Mounted: Yes; Sense: No; Socket: No; SMD: Yes; Manufacturer1 Example: YAGEO PHYCOMP; Manufacturer1 ComponentHeight: 0.4mm; HelpURL: \\cern.ch\dfs\Applications\Altium\Datasheets\R0402_Phycomp_RC0402.pdf; Author: CERN DEM JLC; CreateDate: 03.12.2007; LatestRevisionDate: 17.10.2012
R107 = R0402_6K8_1%_0.0625W_100PPM: Resistor - 1%; Part Description: General Purpose Thick Film Chip Resistor; Manufacturer: GENERIC; Manufacturer1 Part Number: 232270676802L; TC: ±100ppm/°C; PressFit: No; Part Number: R0402_6K8_1%_0.0625W_100PPM; Component Kind: Standard; Component Type: Standard; Pin Count: 2; Value: 6k8; Status: Not Recommended; Power: 0.0625W; Manufacturer Part Number: R0402_6K8_1%_0.0625W_100PPM; Case: 0402; Mounted: Yes; Sense: No; Socket: No; SMD: Yes; Manufacturer1 Example: YAGEO PHYCOMP; Manufacturer1 ComponentHeight: 0.4mm; HelpURL: \\cern.ch\dfs\Applications\Altium\Datasheets\R0402_Phycomp_RC0402.pdf; Author: CERN DEM JLC; CreateDate: 03.12.2007; LatestRevisionDate: 17.10.2012
R108 R130 R133 = R0402_1K5_1%_0.0625W_100PPM: Resistor - 1%; Part Description: General Purpose Thick Film Chip Resistor; Manufacturer: GENERIC; Manufacturer1 Part Number: 232270671502L; TC: ±100ppm/°C; PressFit: No; Part Number: R0402_1K5_1%_0.0625W_100PPM; Component Kind: Standard; Component Type: Standard; Pin Count: 2; Value: 1k5; Status: Not Recommended; Power: 0.0625W; Manufacturer Part Number: R0402_1K5_1%_0.0625W_100PPM; Case: 0402; Mounted: Yes; Sense: No; Socket: No; SMD: Yes; Manufacturer1 Example: YAGEO PHYCOMP; Manufacturer1 ComponentHeight: 0.4mm; HelpURL: \\cern.ch\dfs\Applications\Altium\Datasheets\R0402_Phycomp_RC0402.pdf; Author: CERN DEM JLC; CreateDate: 03.12.2007; LatestRevisionDate: 17.10.2012
R109 = R0402_2K4_1%_0.0625W_100PPM: Resistor - 1%; Part Description: General Purpose Thick Film Chip Resistor; Manufacturer: GENERIC; Manufacturer1 Part Number: 232270672402L; TC: ±100ppm/°C; PressFit: No; Part Number: R0402_2K4_1%_0.0625W_100PPM; Component Kind: Standard; Component Type: Standard; Pin Count: 2; Value: 2k4; Status: Not Recommended; Power: 0.0625W; Manufacturer Part Number: R0402_2K4_1%_0.0625W_100PPM; Case: 0402; Mounted: Yes; Sense: No; Socket: No; SMD: Yes; Manufacturer1 Example: YAGEO PHYCOMP; Manufacturer1 ComponentHeight: 0.4mm; HelpURL: \\cern.ch\dfs\Applications\Altium\Datasheets\R0402_Phycomp_RC0402.pdf; Author: CERN DEM JLC; CreateDate: 03.12.2007; LatestRevisionDate: 17.10.2012
R110 R119 = R0402_1K8_1%_0.0625W_100PPM: Resistor - 1%; Part Description: General Purpose Thick Film Chip Resistor; Manufacturer: GENERIC; Manufacturer1 Part Number: 232270671802L; TC: ±100ppm/°C; PressFit: No; Part Number: R0402_1K8_1%_0.0625W_100PPM; Component Kind: Standard; Component Type: Standard; Pin Count: 2; Value: 1k8; Status: Not Recommended; Power: 0.0625W; Manufacturer Part Number: R0402_1K8_1%_0.0625W_100PPM; Case: 0402; Mounted: Yes; Sense: No; Socket: No; SMD: Yes; Manufacturer1 Example: YAGEO PHYCOMP; Manufacturer1 ComponentHeight: 0.4mm; HelpURL: \\cern.ch\dfs\Applications\Altium\Datasheets\R0402_Phycomp_RC0402.pdf; Author: CERN DEM JLC; CreateDate: 03.12.2007; LatestRevisionDate: 17.10.2012
R118 = R0402_5K6_1%_0.0625W_100PPM: Resistor - 1%; Part Description: General Purpose Thick Film Chip Resistor; Manufacturer: GENERIC; Manufacturer1 Part Number: 232270675602L; TC: ±100ppm/°C; PressFit: No; Part Number: R0402_5K6_1%_0.0625W_100PPM; Component Kind: Standard; Component Type: Standard; Pin Count: 2; Value: 5k6; Status: Not Recommended; Power: 0.0625W; Manufacturer Part Number: R0402_5K6_1%_0.0625W_100PPM; Case: 0402; Mounted: Yes; Sense: No; Socket: No; SMD: Yes; Manufacturer1 Example: YAGEO PHYCOMP; Manufacturer1 ComponentHeight: 0.4mm; HelpURL: \\cern.ch\dfs\Applications\Altium\Datasheets\R0402_Phycomp_RC0402.pdf; Author: CERN DEM JLC; CreateDate: 03.12.2007; LatestRevisionDate: 17.10.2012
R124 R127 R128 = R0402_1K3_1%_0.0625W_100PPM: Resistor - 1%; Part Description: General Purpose Thick Film Chip Resistor; Manufacturer: GENERIC; Manufacturer1 Part Number: 232270671302L; TC: ±100ppm/°C; PressFit: No; Part Number: R0402_1K3_1%_0.0625W_100PPM; Component Kind: Standard; Component Type: Standard; Pin Count: 2; Value: 1k3; Status: Not Recommended; Power: 0.0625W; Manufacturer Part Number: R0402_1K3_1%_0.0625W_100PPM; Case: 0402; Mounted: Yes; Sense: No; Socket: No; SMD: Yes; Manufacturer1 Example: YAGEO PHYCOMP; Manufacturer1 ComponentHeight: 0.4mm; HelpURL: \\cern.ch\dfs\Applications\Altium\Datasheets\R0402_Phycomp_RC0402.pdf; Author: CERN DEM JLC; CreateDate: 03.12.2007; LatestRevisionDate: 17.10.2012
R131 R135 R136 = R0402_2K_1%_0.0625W_100PPM: Resistor - 1%; Part Description: General Purpose Thick Film Chip Resistor; Manufacturer: GENERIC; Manufacturer1 Part Number: 232270672002L; TC: ±100ppm/°C; PressFit: No; Part Number: R0402_2K_1%_0.0625W_100PPM; Component Kind: Standard; Component Type: Standard; Pin Count: 2; Value: 2k; Status: Not Recommended; Power: 0.0625W; Manufacturer Part Number: R0402_2K_1%_0.0625W_100PPM; Case: 0402; Mounted: Yes; Sense: No; Socket: No; SMD: Yes; Manufacturer1 Example: YAGEO PHYCOMP; Manufacturer1 ComponentHeight: 0.4mm; HelpURL: \\cern.ch\dfs\Applications\Altium\Datasheets\R0402_Phycomp_RC0402.pdf; Author: CERN DEM JLC; CreateDate: 03.12.2007; LatestRevisionDate: 17.10.2012
R137 = R0402_12K_1%_0.0625W_100PPM: Resistor - 1%; Part Description: General Purpose Thick Film Chip Resistor; Manufacturer: GENERIC; Manufacturer1 Part Number: 232270671203L; TC: ±100ppm/°C; PressFit: No; Part Number: R0402_12K_1%_0.0625W_100PPM; Component Kind: Standard; Component Type: Standard; Pin Count: 2; Value: 12k; Status: Not Recommended; Power: 0.0625W; Manufacturer Part Number: R0402_12K_1%_0.0625W_100PPM; Case: 0402; Mounted: Yes; Sense: No; Socket: No; SMD: Yes; Manufacturer1 Example: YAGEO PHYCOMP; Manufacturer1 ComponentHeight: 0.4mm; HelpURL: \\cern.ch\dfs\Applications\Altium\Datasheets\R0402_Phycomp_RC0402.pdf; Author: CERN DEM JLC; CreateDate: 03.12.2007; LatestRevisionDate: 17.10.2012
T2 T3 = 2N7002DW: 60 V, 115 mA, Dual N-Channel Field Effect Transistor, Enhancement Mode; Part Description: 60V 115mA Dual N-Channel Field Effect Transistor, Enhancement Mode; Manufacturer: ON SEMICONDUCTOR; PressFit: No; Bonding: No; Part Number: 2N7002DW; Component Kind: Standard; Component Type: Standard; Device: 2N7002DW; PackageDescription: SOT363, SC70-6, 0.65mm Pitch; 6 Pin, 1.25mm W X 2.00mm L X 1.10mm H body, IPC Medium Density; Manufacturer Part Number: 2N7002DW; Pin Count: 6; Case: SOT363; Mounted: Yes; Socket: No; SMD: Yes; Sense: No; ComponentHeight: 1.1mm; HelpURL: \\cern.ch\dfs\Applications\Altium\Datasheets\2N7002DW.pdf; Author: CERN DEM BC; CreateDate: 25.11.2020; LatestRevisionDate: 25.11.2020
TP3-TP5 TP7-TP15 TP18 = SMD_PAD_1.27X1.27MM: Part Description: 1.27mm x 1.27mm PCB Copper Area (SMD Test Point); Mounted: No; Part Number: SMD_PAD_1.27X1.27MM; Component Type: Standard (No BOM); Pin Count: 1; Family: Test Point; Socket: No; Sense: No; Status: None; ComponentHeight: 0mm; HelpURL: Undefined; Author: CERN DEM JLC; CreateDate: 12.01.2008; LatestRevisionDate: 12.01.2008; PackageDescription: 1.27mm x 1.27mm PCB Copper Area (SMD Test Point)
  TP3: SMD: Yes
  TP4 TP5 TP7-TP15 TP18: SMD: No